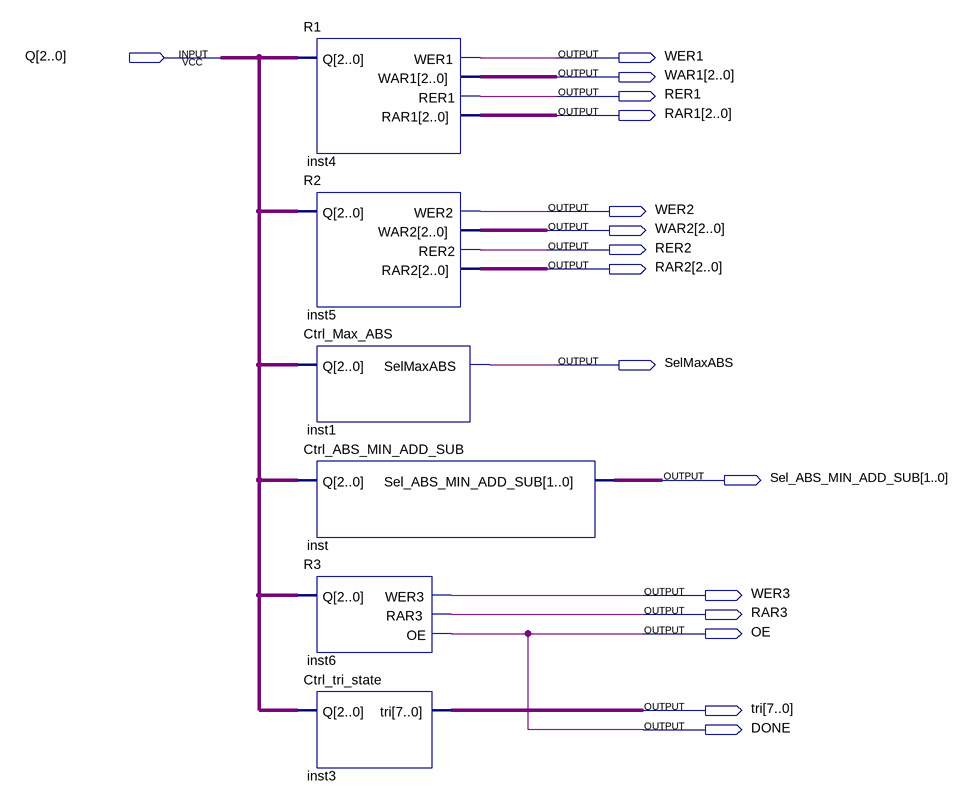
[diagram p0: schematic sheet]
// Quartus schematic Outputlogic.bdf as structural Verilog: 6 symbols, 16 pins
module Outputlogic (
  input  [2:0] Q,
  output WER1,
  output [2:0] WAR1,
  output RER1,
  output [2:0] RAR1,
  output WER2,
  output [2:0] WAR2,
  output RER2,
  output [2:0] RAR2,
  output SelMaxABS,
  output [1:0] Sel_ABS_MIN_ADD_SUB,
  output WER3,
  output RAR3,
  output OE,
  output [7:0] \tri ,
  output DONE
);

  R1 inst4 (.Q(Q), .WER1(WER1), .WAR1(WAR1), .RER1(RER1), .RAR1(RAR1));
  R2 inst5 (.Q(Q), .WER2(WER2), .WAR2(WAR2), .RER2(RER2), .RAR2(RAR2));
  Ctrl_Max_ABS inst1 (.Q(Q), .SelMaxABS(SelMaxABS));
  Ctrl_ABS_MIN_ADD_SUB inst (.Q(Q), .Sel_ABS_MIN_ADD_SUB(Sel_ABS_MIN_ADD_SUB));
  R3 inst6 (.Q(Q), .WER3(WER3), .RAR3(RAR3), .OE(DONE));
  Ctrl_tri_state inst3 (.Q(Q), .\tri (\tri ));

  assign OE = DONE;
endmodule
